# EAGLE design Ryan and Jimmy Schematic Attempt (EAGLE 9.2.2)
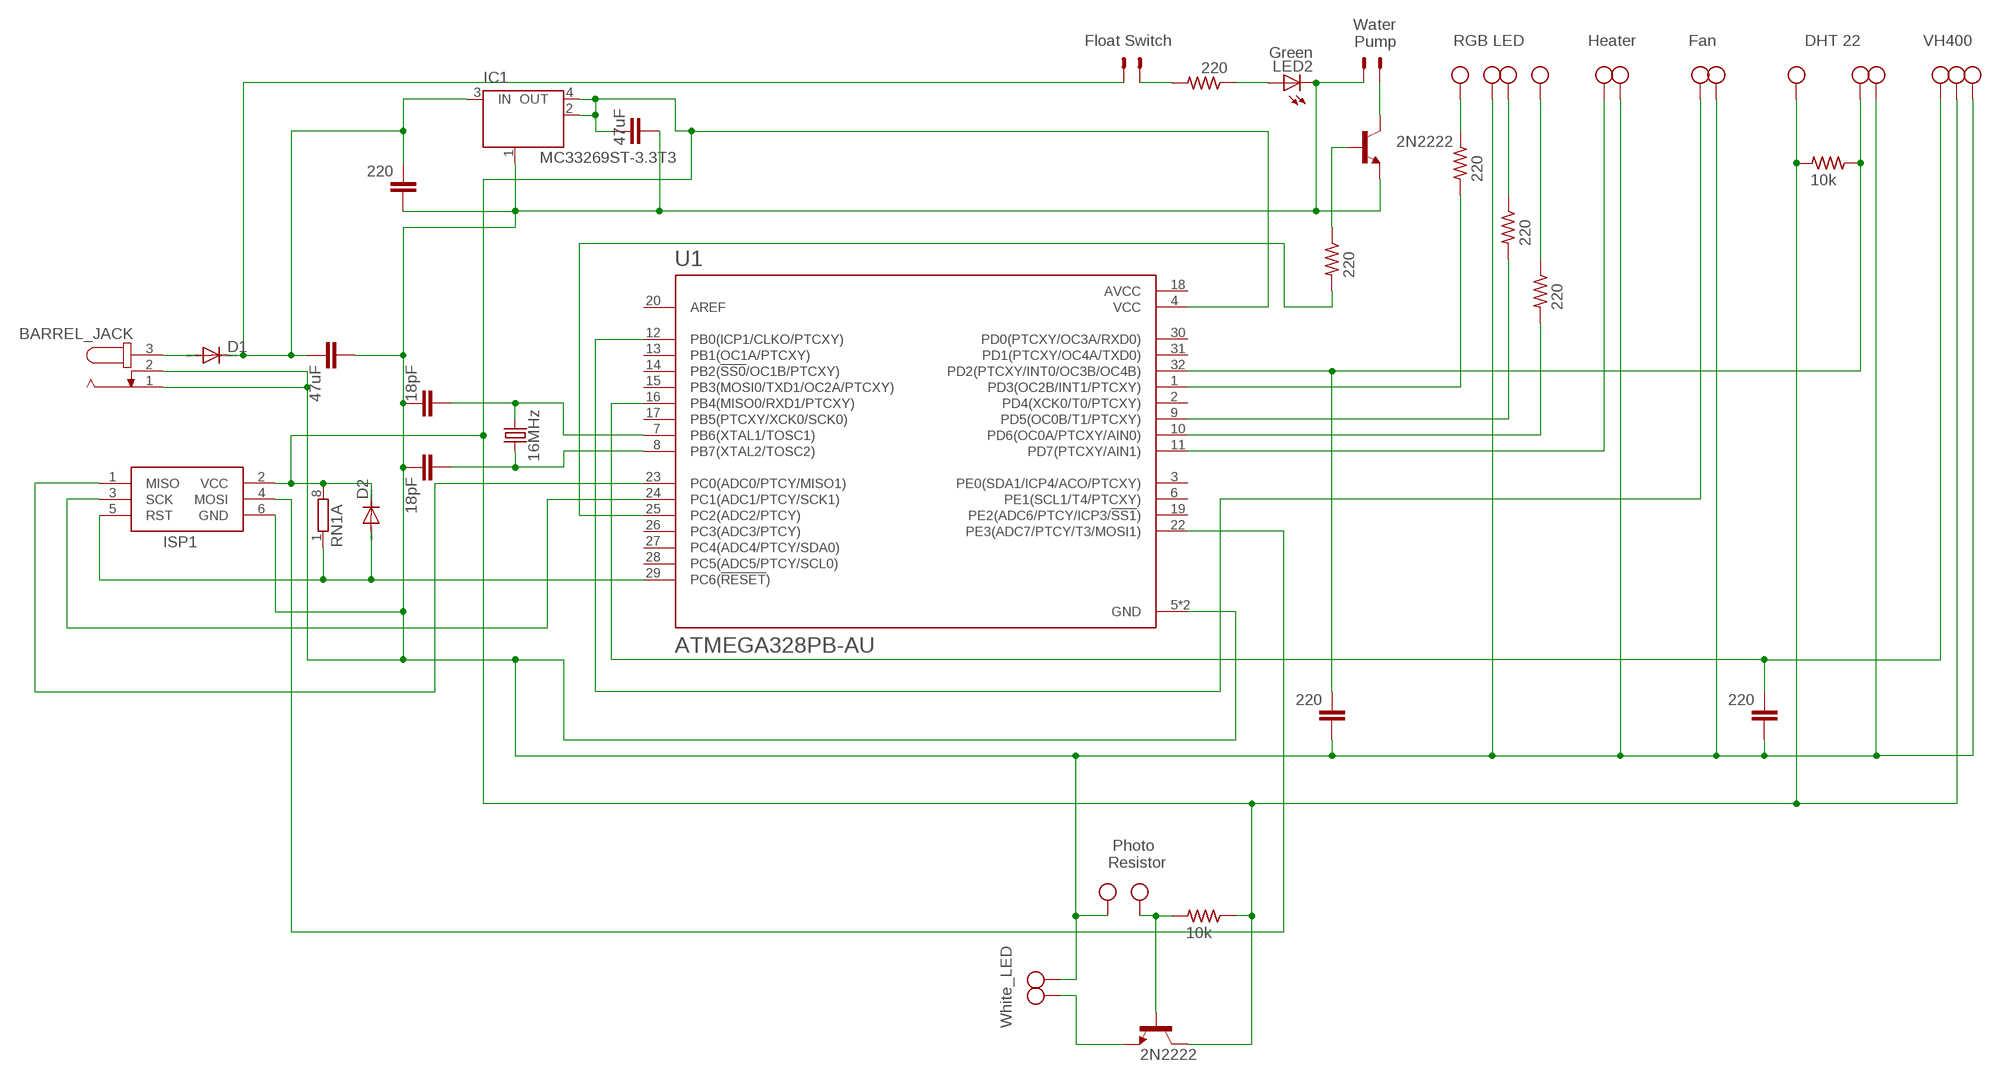
[diagram p0: schematic, sheet 1]

## Parts
BARREL_JACK  JACK-PLUG1  [SPC4078]
C1  220  C-EU025-024X044  [C025-024X044]
C3  47uF  C-EU025-024X044  [C025-024X044]
C6  220  C-EU025-024X044  [C025-024X044]
C8  47uF  C-EU025-024X044  [C025-024X044]
C9  18pF  C-EU025-024X044  [C025-024X044]
C11  220  C-EU025-024X044  [C025-024X044]
C12  18pF  C-EU025-024X044  [C025-024X044]
D1  DIODE-DO214BA  [DO214BA]
D2  DIODE-DO214BA  [DO214BA]
IC1  MC33269ST-3.3T3  [SOT223]
ISP1  AVRISP-6  [AVRISP]
LED2  Green  LEDCHIPLED_0805  [CHIPLED_0805]
R1  220  R-US_R0805  [R0805]
R2  220  R-US_R0805  [R0805]
R3  10k  R-US_R0805  [R0805]
R4  220  R-US_R0805  [R0805]
R6  220  R-US_R0805  [R0805]
R7  220  R-US_R0805  [R0805]
R8  10k  R-US_R0805  [R0805]
RN1  4R-NCAY16  [CAY16]
T1  2N2222  [TO18]
T2  2N2222  [TO18]
U1  ATMEGA328PB-AU  [QFP80P900X900X120-32N]
X1  1X03_5MM_SCREW  [W237-103]
X2  1X02_5MM_SCREW  [W237-102]
X3  1X03_5MM_SCREW  [W237-103]
X4  1X02_5MM_SCREW  [W237-102]
X6  1X02_5MM_SCREW  [W237-102]
X7  W237-4  [W237-4]
X8  1X02_5MM_SCREW  [W237-102]
X9  332-02  [332-02]
X10  332-02  [332-02]
Y1  16MHz  CRYSTALSMD-3.2X1.5  [CRYSTAL-SMD-3.2X1.5MM]

## Nets
5V: C3.2 D2.C IC1.2(OUT) IC1.4(OUT) ISP1.2(VCC) R3.1 R8.2 RN1.8 T2.3(C) U1.4(VCC) X1.3 X3.2
BLUE: R7.1 X7.1
BLUOUT: R7.2 U1.10(PD6(OC0A/PTCXY/AIN0))
DHT: C6.2 R8.1 U1.32(PD2(PTCXY/INT0/OC3B/OC4B)) X1.2
F_S: R1.2 X10.1
FAN: U1.12(PB0(ICP1/CLKO/PTCXY)) X8.2
GND: BARREL_JACK.1 BARREL_JACK.2 C1.1 C3.1 C6.1 C8.1 C9.2 C11.1 C12.2 IC1.1(GND/ADJ) ISP1.6(GND) LED2.C T1.1(E) U1.5(GND) U1.21(GND) X1.1 X2.2 X3.1 X4.1 X6.2 X7.3 X8.1 X9.1
GREEN: R6.1 X7.2
GRNOUT: R6.2 U1.9(PD5(OC0B/T1/PTCXY))
HEAT: U1.11(PD7(PTCXY/AIN1)) X4.2
MISO: ISP1.1(MISO) U1.23(PC0(ADC0/PTCY/MISO1))
MOSI: ISP1.4(MOSI) U1.22(PE3(ADC7/PTCY/T3/MOSI1))
N$19: LED2.A R1.1
P_CON: R4.1 T1.2(B)
PHOTO: R3.2 T2.2(B) X2.1
POUT: R4.2 U1.25(PC2(ADC2/PTCY))
PUMP: T1.3(C) X9.2
PWRIN: BARREL_JACK.3 D1.A
RED: R2.1 X7.4
REDOUT: R2.2 U1.1(PD3(OC2B/INT1/PTCXY))
RESET: D2.A ISP1.5(RST) RN1.1 U1.29(PC6(!RESET!))
SCK: ISP1.3(SCK) U1.24(PC1(ADC1/PTCY/SCK1))
VH400: C11.2 U1.16(PB4(MISO0/RXD1/PTCXY)) X3.3
VIN: C1.2 C8.2 D1.C IC1.3(IN) X10.2
WHT_LED: T2.1(E) X6.1
XTAL1: C9.1 U1.7(PB6(XTAL1/TOSC1)) Y1.P$2
XTAL2: C12.1 U1.8(PB7(XTAL2/TOSC2)) Y1.P$1
Unconnected: RN1.2 RN1.3 RN1.4 RN1.5 RN1.6 RN1.7 U1.2(PD4(XCK0/T0/PTCXY)) U1.3(PE0(SDA1/ICP4/ACO/PTCXY)) U1.6(PE1(SCL1/T4/PTCXY)) U1.13(PB1(OC1A/PTCXY)) U1.14(PB2(!SS0!/OC1B/PTCXY)) U1.15(PB3(MOSI0/TXD1/OC2A/PTCXY)) U1.17(PB5(PTCXY/XCK0/SCK0)) U1.19(PE2(ADC6/PTCY/ICP3/!SS1!)) U1.20(AREF) U1.26(PC3(ADC3/PTCY)) U1.27(PC4(ADC4/PTCY/SDA0)) U1.28(PC5(ADC5/PTCY/SCL0)) U1.30(PD0(PTCXY/OC3A/RXD0)) U1.31(PD1(PTCXY/OC4A/TXD0))

## Notes on the sheet
- Water
  Pump
- Float Switch | RGB LED | Heater | Fan | DHT 22 | VH400
- Photo
  Resistor
- White_LED

## Power pins joined to a net without a drawn wire
AVCC: U1.18(AVCC)

## Library data of the parts
BARREL_JACK = con-jack:JACK-PLUG: DC POWER JACK Power Jack, DC, Right Angle, Through Hole, Rated 5A at 16VDC, PC Terminals Distributor: Farnell (www.Farnell.de) Drawing: 84N1161.pdf / 84N1162.pdf Manufacturer: SPC Technology (www.spctechnology.com) Type: SPC4077 / SPC 4078; OC_FARNELL: unknown; OC_NEWARK: unknown
C1 C3 C6 C8 C9 C11 C12 = rcl:C-EU: CAPACITOR, European symbol; SPICEPREFIX: C
D1 D2 = diode:DIODE-: DIODE
IC1 = linear:MC33269ST*: Adjustable Output Low Dropout Voltage Regulator 800 mA Source: http://www.onsemi.com/pub/Collateral/MC33269-D.PDF
ISP1 = ECE388:AVRISP: AVR ISP HEADER Standard 6 pin header for AVR programming
LED2 = led:LED: LED OSRAM: - CHIPLED LG R971, LG N971, LY N971, LG Q971, LY Q971, LO R971, LY R971 LH N974, LH R974 LS Q976, LO Q976, LY Q976 LO Q996 - Hyper CHIPLED LW Q18S LB Q993, LB Q99A, LB R99A - SideLED LS A670, LO A670, LY A670, LG A670, LP A670 LB A673, LV A673, LT A673, LW A673 LH A674 LY A675 LS A676, LA A676, LO A676, LY A676, LW A676 LS A679, LY A679, LG A679 - Hyper Micro SIDELED® LS Y876, LA Y876, LO Y876, LY Y876 LT Y87S - SmartLED LW L88C, LW L88S LB L89C, LB L89S, LG L890 LS L89K, LO L89K, LY L89K LS L896, LA L896, LO L896, LY L896 - TOPLED LS T670, LO T670, LY T670, LG T670, LP T670 LSG T670, LSP T670, LSY T670, LOP T670, LYG T670 LG T671, LOG T671, LSG T671 LB T673, LV T673, LT T673, LW T673 LH T674 LS T676, LA T676, LO T676, LY T676, LB T676, LH T676, LSB T676, LW T676 LB T67C, LV T67C, LT T67C, LS T67K, LO T67K, LY T67K, LW E67C LS E67B, LA E67B, LO E67B, LY E67B, LB E67C, LV E67C, LT E67C LW T67C LS T679, LY T679, LG T679 LS T770, LO T770, LY T770, LG T770, LP T770 LB T773, LV T773, LT T773, LW T773 LH T774 LS E675, LA E675, LY E675, LS T675 LS T776, LA T776, LO T776, LY T776, LB T776 LHGB T686 LT T68C, LB T68C - Hyper Mini TOPLED® LB M676 - Mini TOPLED Santana® LG M470 LS M47K, LO M47K, LY M47K Source: http://www.osram.convergy.de LUXEON: - LUMILED® LXK2-PW12-R00, LXK2-PW12-S00, LXK2-PW14-U00, LXK2-PW14-V00 LXK2-PM12-R00, LXK2-PM12-S00, LXK2-PM14-U00 LXK2-PE12-Q00, LXK2-PE12-R00, LXK2-PE12-S00, LXK2-PE14-T00, LXK2-PE14-U00 LXK2-PB12-K00, LXK2-PB12-L00, LXK2-PB12-M00, LXK2-PB14-N00, LXK2-PB14-P00, LXK2-PB14-Q00 LXK2-PR12-L00, LXK2-PR12-M00, LXK2-PR14-Q00, LXK2-PR14-R00 LXK2-PD12-Q00, LXK2-PD12-R00, LXK2-PD12-S00 LXK2-PH12-R00, LXK2-PH12-S00 LXK2-PL12-P00, LXK2-PL12-Q00, LXK2-PL12-R00 Source: www.luxeon.com KINGBRIGHT: KA-3528ASYC Source: www.kingbright.com
R1-R4 R6-R8 = rcl:R-US_: RESISTOR, American symbol; SPICEPREFIX: R
RN1 = resistor-dil:4R-N: Array Chip Resistor Source: RS Component / Phycomp; OC_FARNELL: unknown; OC_NEWARK: unknown
T1 T2 = transistor-neu-to92:2N2222: NPN TRANSISTOR
U1 = ATMEGA328PB-AU:ATMEGA328PB-AU: ATmega Series 20 MHz 32 KB Flash 2 KB SRAM 8-Bit Microcontroller - TQFP-32; AVAILABILITY: Unavailable; DESCRIPTION: AVR microcontroller; EEPROM: 1024B; SRAM: 2kB; Flash: 32kB; TQFP32; MF: Microchip; MP: ATMEGA328PB-AU; PACKAGE: TQFP-32 Microchip; PRICE: None
X1 X3 = ECE388:1X03_5MM_SCREW: WAGO SCREW CLAMP; MPN: 237-103; OC_FARNELL: unknown; OC_NEWARK: 18M7116
X2 X4 X6 X8 = ECE388:1X02_5MM_SCREW: WAGO SCREW CLAMP; MPN: 237-102; OC_FARNELL: unknown; OC_NEWARK: 70K9898
X7 = con-wago-500:W237-4: WAGO SCREW CLAMP; OC_FARNELL: unknown; OC_NEWARK: unknown
X9 X10 = con-garry:332-02: 2 Pin - 2mm Dual Row Source: www.mpe-connector.de / garry_shortform_2012.pdf
Y1 = SparkFun-Clocks:CRYSTAL: Crystals (Generic) These are passive quartz crystals, which can be used as a clock source for a microcontroller. Crystal's are two-terminal devices. They require external "load" capacitors to generate an oscillating signal.

## Board
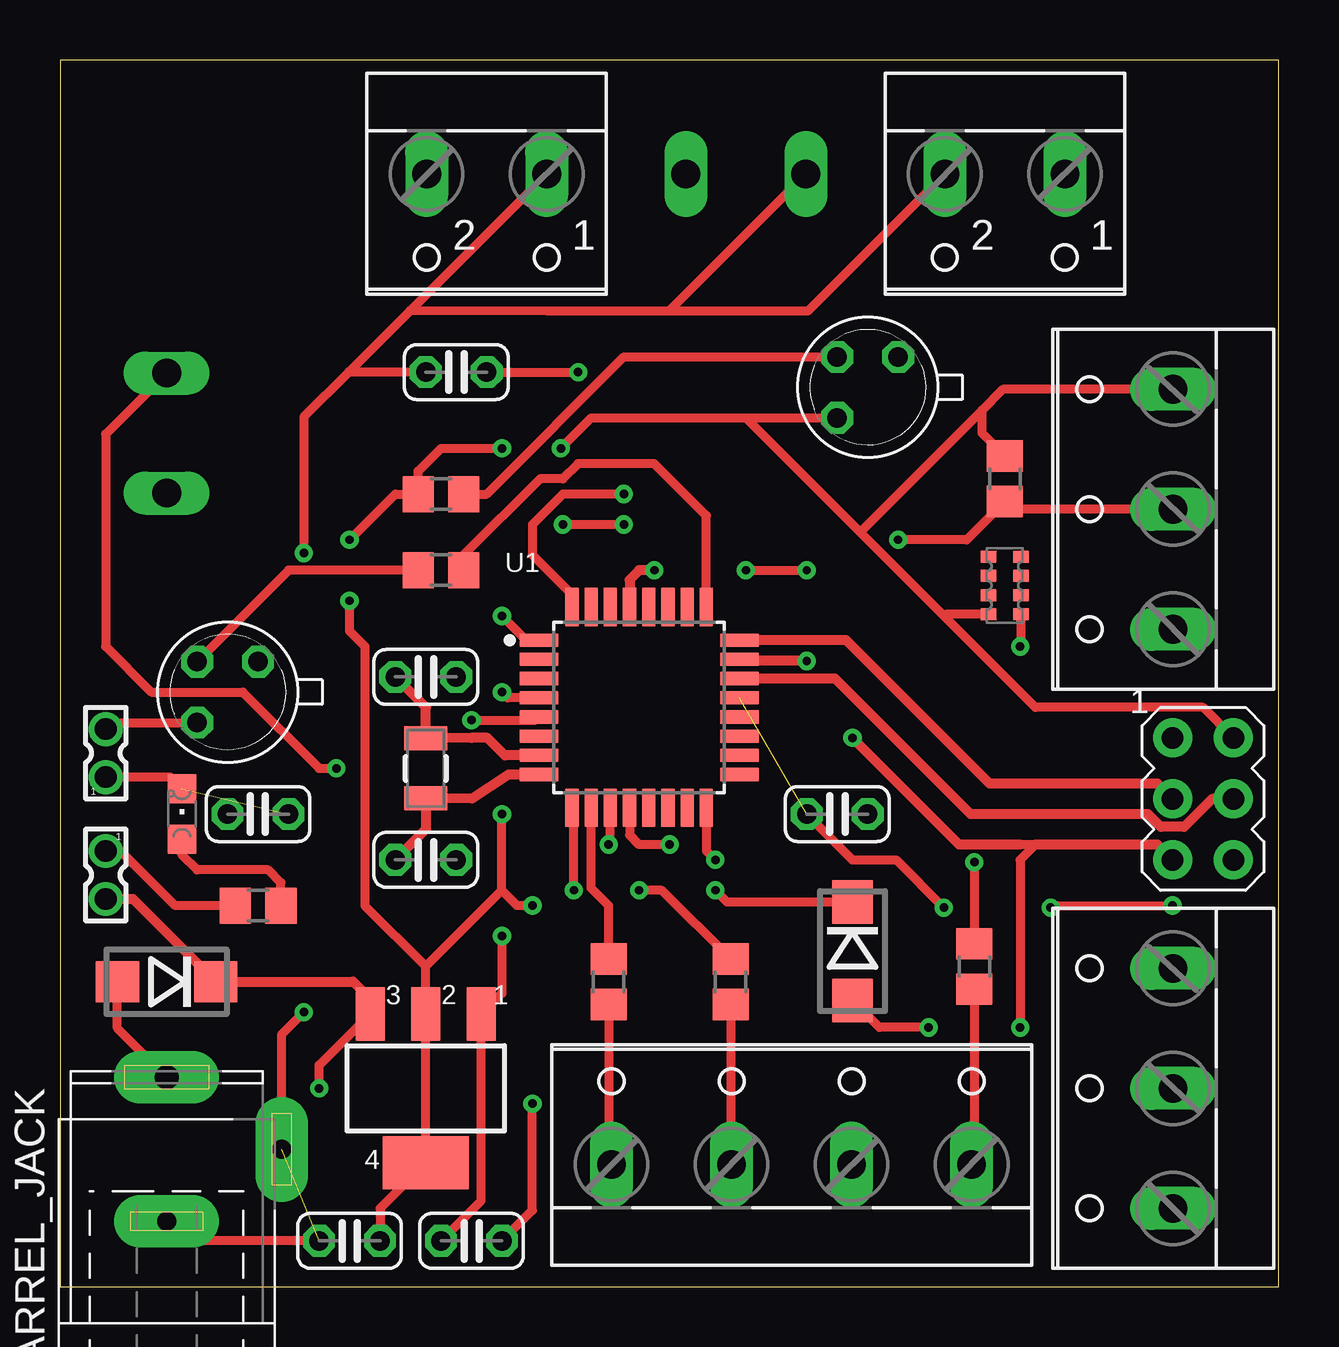
[diagram p1: board, top side]
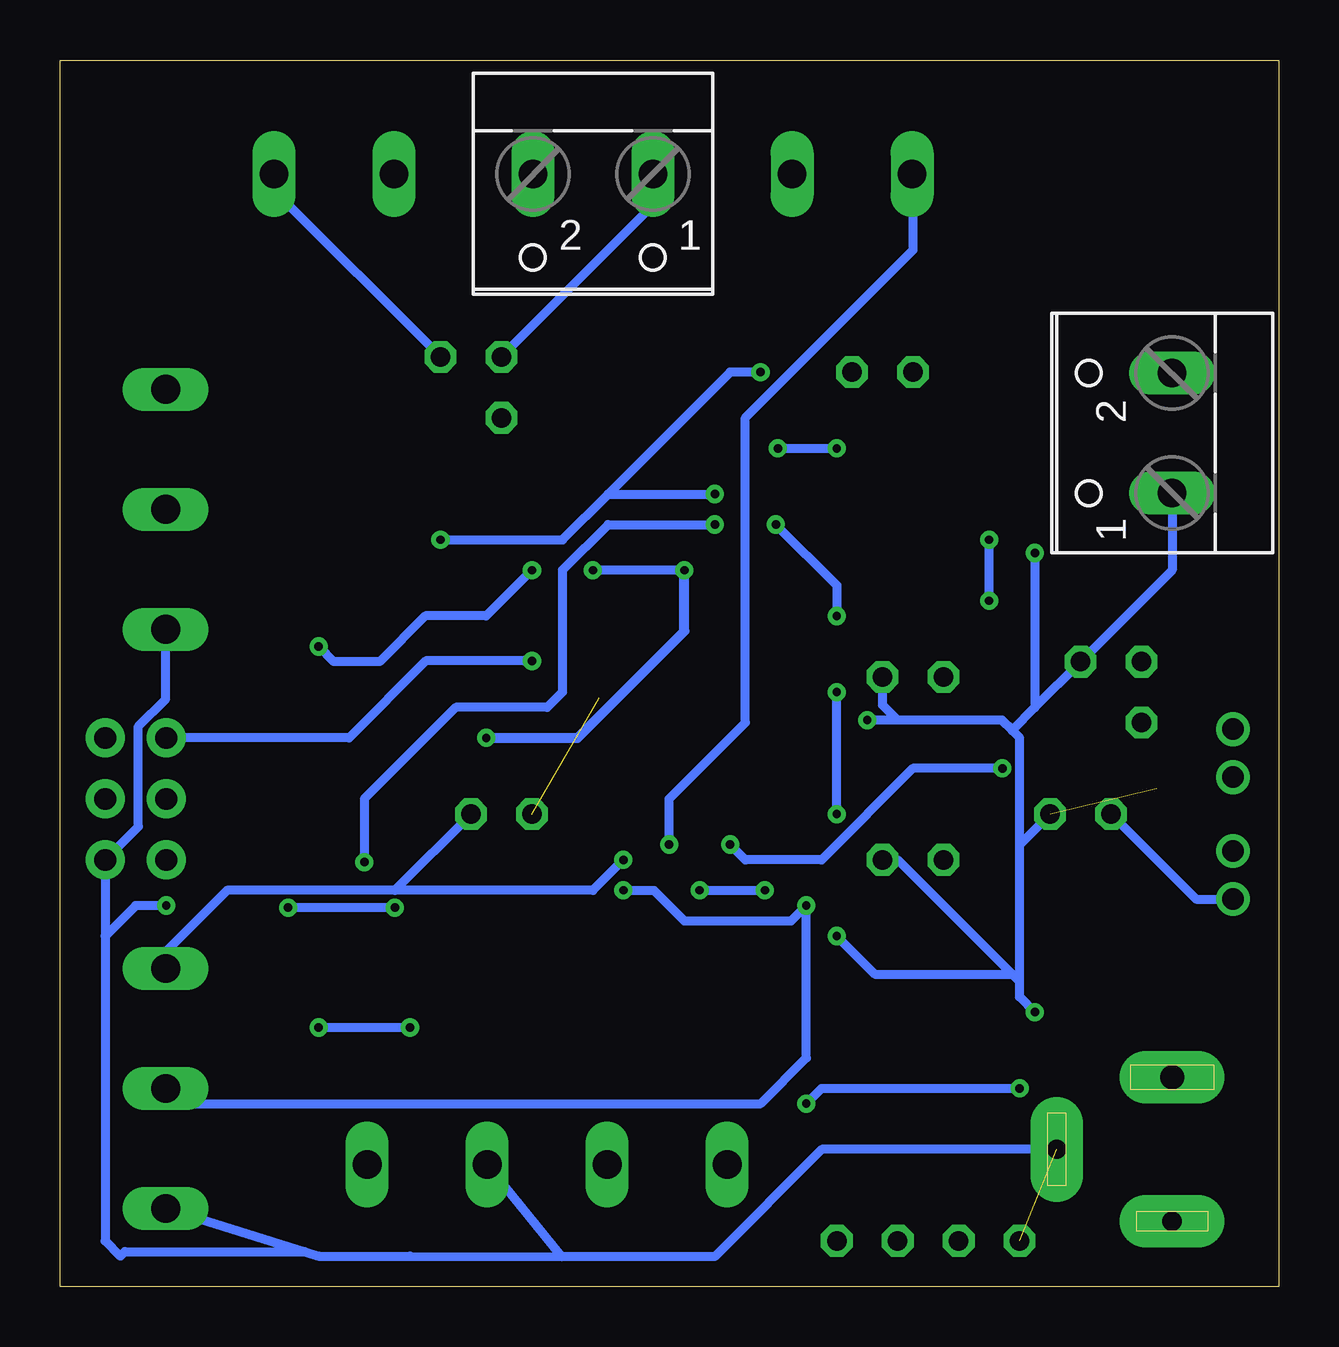
[diagram p2: board, bottom side, seen from below]

Size 50.78 x 51.1 mm. Coordinates in mm from the lower left corner, seen from the top.
Outline: 0,0 50.78,0 50.78,51.1 0,51.1 0,0
Copper layers (1*16): Top 0.035mm / dielectric 1.5mm / Bottom 0.035mm
Design rules "default": minimum track width 6mil, minimum drill 0.35mm, track to track 6mil, track to pad 6mil, pad to pad 6mil, via to via 6mil, smd to smd 6mil, copper to edge 40mil, drill to drill 6mil, minimum pad ring 10mil, minimum via ring 8mil, stop-mask expansion 4mil, vias tented up to drill 0mil, thermal gap 10mil

### Footprints (pad centres in the part's own frame; a part is rotated, then mirrored left to right if it is on the bottom)
SPC4078 = drill 0.8 pad 2.184 long: 1 -3,0; 2 0,-4.8 | drill 1 pad 2.184 long: 3 3,0
C025-024X044 = drill 0.813 octagon: 1 -1.27,0; 2 1.27,0
DO214BA = smd 1.8 x 1.7: A 2.05,0; C -2.05,0
SOT223 = smd 1.219 x 2.235: 1 -2.311,-3.099; 2 0,-3.099; 3 2.311,-3.099 | smd 3.6 x 2.2: 4 0,3.099
AVRISP = drill 0.9 pad 1.626: 1 -1.27,2.54; 2 1.27,2.54; 3 -1.27,0; 4 1.27,0; 5 -1.27,-2.54; 6 1.27,-2.54
CHIPLED_0805 = smd 1.2 x 1.2: A 0,-1.05; C 0,1.05
R0805 = smd 1.3 x 1.5: 1 -0.95,0; 2 0.95,0
CAY16 = smd 0.5 x 0.65: 1 -1.2,-0.675; 2 -0.4,-0.675; 3 0.4,-0.675; 4 1.2,-0.675; 5 1.2,0.675; 6 0.4,0.675; 7 -0.4,0.675; 8 -1.2,0.675
TO18 = drill 0.813 octagon: 1 -1.27,-1.27; 2 1.27,-1.27; 3 1.27,1.27
QFP80P900X900X120-32N = smd 1.6 x 0.55: 1 -4.18,2.8; 2 -4.18,2; 3 -4.18,1.2; 4 -4.18,0.4; 5 -4.18,-0.4; 6 -4.18,-1.2; 7 -4.18,-2; 8 -4.18,-2.8; 17 4.18,-2.8; 18 4.18,-2; 19 4.18,-1.2; 20 4.18,-0.4; 21 4.18,0.4; 22 4.18,1.2; 23 4.18,2; 24 4.18,2.8 | smd 0.55 x 1.6: 9 -2.8,-4.18; 10 -2,-4.18; 11 -1.2,-4.18; 12 -0.4,-4.18; 13 0.4,-4.18; 14 1.2,-4.18; 15 2,-4.18; 16 2.8,-4.18; 25 2.8,4.18; 26 2,4.18; 27 1.2,4.18; 28 0.4,4.18; 29 -0.4,4.18; 30 -1.2,4.18; 31 -2,4.18; 32 -2.8,4.18
W237-103 = drill 1.194 long: 1 -5,-1.29; 2 0,-1.29; 3 5,-1.29
W237-102 = drill 1.194 long: 1 -2.5,-1.27; 2 2.5,-1.27
W237-4 = drill 1.194 long: 1 -7.5,-1.27; 2 -2.5,-1.27; 3 2.5,-1.27; 4 7.5,-1.27
332-02 = drill 0.9 pad 1.27: 1 0,-1; 2 0,1
CRYSTAL-SMD-3.2X1.5MM = smd 1 x 1.8: P$1 -1.25,0; P$2 1.25,0

### Placement (x,y rotation side)
BARREL_JACK  4.45,5.71 90 top
C1  8.26,19.68 180 top
C3  12.06,1.91 0 top
C6  16.51,38.1 0 top
C8  17.14,1.91 0 top
C9  15.24,25.4 0 top
C11  32.38,19.68 0 top
C12  15.24,17.78 0 top
D1  4.45,12.7 180 top
D2  33.02,13.97 270 top
IC1  15.24,8.26 180 top
ISP1  47.62,20.32 0 top
LED2  5.08,19.68 0 top
R1  8.26,15.88 180 top
R2  38.1,13.34 90 top
R3  15.88,33.02 0 top
R4  15.88,29.84 0 top
R6  27.94,12.7 90 top
R7  22.86,12.7 90 top
R8  39.37,33.66 90 top
RN1  39.37,29.21 90 top
T1  6.99,24.77 180 top
T2  33.66,37.47 180 top
U1  24.13,24.13 0 top
X1  45.09,32.38 90 top
X2  28.57,45.09 180 bottom
X3  45.09,8.26 90 top
X4  5.71,35.56 90 bottom
X6  39.37,45.09 180 top
X7  30.48,6.35 0 top
X8  17.78,45.09 180 top
X9  1.91,22.23 0 top
X10  1.91,17.14 180 top
Y1  15.24,21.59 90 top

### Tracks (layer width: path | path; a pad name or v marks a point on that pad's centre or on a via)
5V  (via drill 0.35)
  Top 0.381: 15.24,13.34 IC1.2 IC1.4 13.34,3.25 C3.2 | 18.41,16.51 v18.41,19.68 | U1.4 18.65,24.53 v18.41,24.77 | 15.24,13.34 18.41,16.51 | 15.24,13.34 12.7,15.88 12.7,26.67 12.06,27.3 v12.06,28.57 | v12.06,31.11 13.97,33.02 R3.1 14.93,33.98 15.88,34.92 v18.41,34.92 | v20.87,34.92 22.14,36.2 28.57,36.2 | 28.57,36.2 T2.3 | D2.C 27.8,16.02 v27.3,16.51 | v19.68,15.88 19.05,15.88 18.41,16.51 | ISP1.2 47.62,24.13 40.64,24.13 36.83,27.94 | 36.83,27.94 33.34,31.43 | 33.34,31.43 28.57,36.2 | RN1.8 36.9,28.01 36.83,27.94 | X1.3 39.29,37.38 38.42,36.51 | 38.42,36.51 33.34,31.43 | R8.2 38.42,35.56 38.42,36.51
  Bottom 0.381: v18.41,19.68 v18.41,24.77 | v12.06,28.57 v12.06,31.11 | v20.87,34.92 v18.41,34.92 | v27.3,16.51 26.04,16.51 24.77,15.24 20.32,15.24 v19.68,15.88 19.68,9.53 21.59,7.62 45.74,7.62 X3.2
BLUE
  Top 0.381: R7.1 22.86,5.2 X7.1
BLUOUT
  Top 0.381: R7.2 22.86,15.88 22.13,16.61 U1.10
DHT  (via drill 0.35)
  Top 0.381: X1.2 39.69,32.38 R8.1 37.78,31.11 v34.92,31.11 | v23.5,33.02 20.95,33.02 19.68,31.75 19.68,30.48 21.33,28.84 U1.32 | C6.2 v21.59,38.1
  Bottom 0.381: v34.92,31.11 29.84,31.11 27.94,33.02 | 27.94,33.02 v23.5,33.02 | v21.59,38.1 22.86,38.1 27.94,33.02
F_S
  Top 0.381: R1.2 4.81,15.88 2.54,18.14 X10.1
FAN  (via drill 0.35)
  Top 0.381: v25.4,18.41 24.13,18.41 23.73,18.82 U1.12
  Bottom 0.381: v25.4,18.41 25.4,20.32 22.23,23.5 22.23,36.2 15.24,43.18 15.24,46.31 X8.2
GND  (via drill 0.35)  (3 unrouted)
  Top 0.381: LED2.C 4.59,21.23 X9.1 | BARREL_JACK.2 9.24,10.52 v10.16,11.43 | v17.14,23.6 19.82,23.6 U1.5 | X8.1 14.59,40.66 | 14.59,40.66 12.04,38.12 | 12.04,38.12 10.16,36.23 v10.16,30.57 | X2.2 25.36,40.64 | 25.36,40.64 20.32,40.64 14.59,40.66 | v18.41,14.61 18.41,12.22 IC1.1 17.55,3.58 C8.1 | C6.1 12.06,38.1 12.04,38.12 | C11.1 33.02,17.78 34.84,17.78 v36.83,15.79 | v41.27,15.79 41.36,15.88 v46.35,15.88 | C3.1 5.25,1.91 BARREL_JACK.1 | X6.2 31.16,40.64 25.36,40.64
  Bottom 0.381: v10.16,11.43 10.79,12.06 10.79,12.7 | 10.79,12.7 10.79,18.41 | 10.79,18.41 10.79,22.86 11.11,23.18 | 11.11,23.18 11.53,23.6 15.88,23.6 | 15.88,23.6 v17.14,23.6 | C9.2 16.51,24.23 15.88,23.6 | C12.2 15.88,17.78 11.11,13.02 | 11.11,13.02 10.79,12.7 | 10.16,24.13 T1.1 4.45,29.84 X4.1 | 10.16,24.13 11.11,23.18 | v10.16,30.57 10.16,24.13 | BARREL_JACK.2 19.04,5.71 23.51,1.25 29.88,1.25 | 29.88,1.25 X7.3 | X3.1 40.58,1.45 | 40.58,1.45 40.01,1.27 36.2,1.27 29.88,1.25 | v18.41,14.61 16.83,13.02 11.11,13.02 | 48.9,14.61 ISP1.6 47.51,19.16 47.51,23.34 46.38,24.47 X1.1 | 48.9,14.61 48.9,1.91 48.26,1.27 48.08,1.45 40.58,1.45 | v36.83,15.79 v41.27,15.79 | v46.35,15.88 47.62,15.88 48.9,14.61 | C1.1 10.79,18.41
GREEN
  Top 0.381: R6.1 27.94,5.12 X7.2
GRNOUT  (via drill 0.35)
  Top 0.381: R6.2 25.08,16.51 v24.13,16.51 | v21.41,16.51 21.41,19.87 U1.9
  Bottom 0.381: v24.13,16.51 v21.41,16.51
HEAT  (via drill 0.35)
  Top 0.381: X4.2 1.91,35.52 1.91,26.67 3.81,24.77 7.62,24.77 10.79,21.59 v11.52,21.59 | v22.86,18.41 22.93,18.48 U1.11
  Bottom 0.381: v11.52,21.59 15.24,21.59 19.05,17.78 22.23,17.78 v22.86,18.41
MISO  (via drill 0.35)
  Top 0.406: v31.11,26.06 28.38,26.06 U1.23
  Bottom 0.381: 31.38,26.06 35.53,26.06 38.73,22.86 ISP1.1
  Bottom 0.406: v31.11,26.06 31.38,26.06
MOSI
  Top 0.406: ISP1.4 48.01,20.32 46.84,19.15 45.87,19.15 45.34,19.68 37.95,19.68 32.3,25.33 U1.22
N$19
  Top 0.381: R1.1 9.21,16.83 8.67,17.36 5.71,17.36 5.08,18 LED2.A
P_CON
  Top 0.381: T1.2 9.53,29.84 R4.1
PHOTO
  Top 0.381: R3.2 17.78,33.02 23.5,38.73 T2.2
  Bottom 0.381: T2.2 26.07,45.05 X2.1
POUT
  Top 0.381: U1.25 26.93,32.12 24.76,34.29 21.59,34.29 20.95,33.66 20,33.66 16.82,30.48 R4.2
PUMP
  Top 0.381: X9.2 2.17,23.5 T1.3
PWRIN
  Top 0.381: BARREL_JACK.3 2.4,10.77 D1.A
RED
  Top 0.381: R2.1 38.1,5.2 X7.4
REDOUT  (via drill 0.35)
  Top 0.381: v23.5,31.75 v20.95,31.75 | v18.41,27.94 19.43,26.93 U1.1 | v38.1,17.68 R2.2
  Bottom 0.381: v23.5,31.75 27.94,31.75 29.84,29.84 29.84,24.77 30.48,24.13 34.29,24.13 38.1,20.32 v38.1,17.68 | v20.95,31.75 18.41,29.21 v18.41,27.94
RESET  (via drill 0.35)
  Top 0.381: v40.01,10.79 40.01,17.78 40.64,18.41 39.37,18.41 | v36.2,10.79 34.15,10.79 D2.A | v28.57,29.84 v31.11,29.84 | v40.01,26.67 40.05,26.71 RN1.1
  Top 0.406: ISP1.5 45.72,18.41 40.64,18.41 | 40.01,18.41 39.37,18.41 37.47,18.41 v33.02,22.86 | v24.77,29.84 24.13,29.84 23.73,29.45 U1.29
  Bottom 0.381: v40.01,10.79 v36.2,10.79 | v24.77,29.84 v28.57,29.84 | v31.11,29.84 33.02,27.94 35.56,27.94 37.47,26.04 39.37,26.04 v40.01,26.67
  Bottom 0.406: v33.02,22.86 29.21,22.86 24.77,27.3 v24.77,29.84
SCK
  Top 0.406: ISP1.3 45.72,20.95 38.73,20.95 32.76,26.93 U1.24
VH400  (via drill 0.35)
  Top 0.381: U1.16 26.93,18.16 v27.3,17.78
  Bottom 0.381: v27.3,17.78 28.57,16.51 36.83,16.51 | 36.83,16.51 43.81,16.51 46.38,13.95 X3.3 | C11.2 36.83,16.51
VIN  (via drill 0.35)
  Top 0.381: C8.2 19.68,3.17 v19.68,7.62 | v10.79,8.26 10.79,9.22 IC1.3
  Top 0.406: IC1.3 12.93,11.98 12.21,12.7 D1.C 3.05,16.14 X10.2
  Bottom 0.381: C1.2 3.44,16.14 X10.2 | v19.68,7.62 19.05,8.26 v10.79,8.26
WHT_LED
  Bottom 0.381: T2.1 41.87,45.68 X6.1
XTAL1
  Top 0.406: C9.1 15.24,24.13 Y1.P$2 17.14,22.86 17.81,22.86 18.54,22.13 U1.7
XTAL2
  Top 0.406: C12.1 15.24,19.05 Y1.P$1 17.16,20.33 18.68,21.33 U1.8